# EAGLE schematic glove (EAGLE 6.6.0)

## Sheet 1 of 3
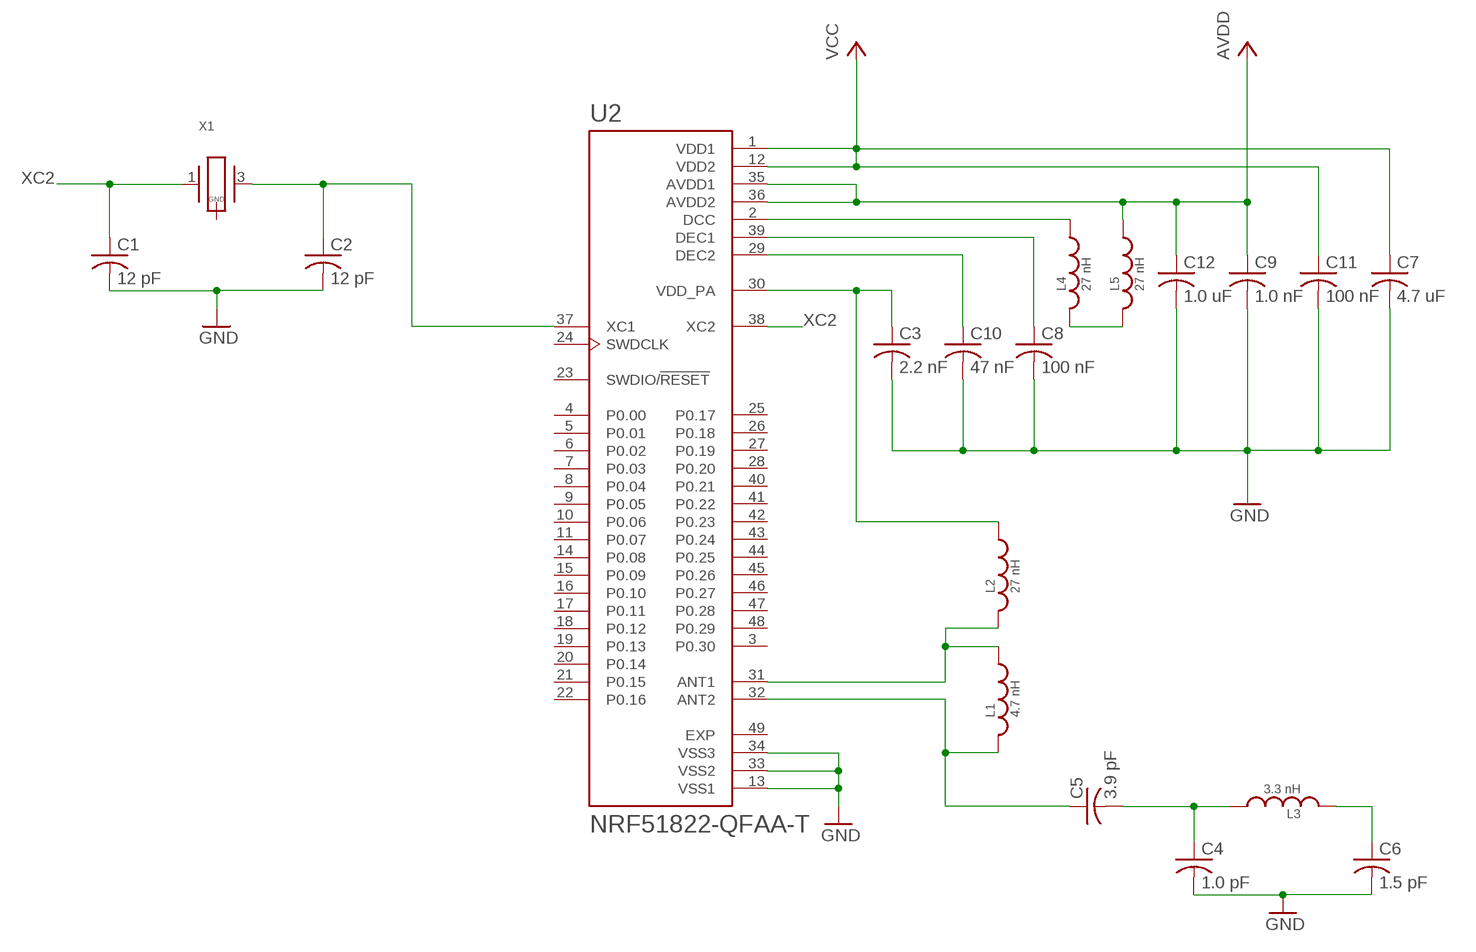
[diagram p0: schematic, sheet 1]

### Parts
C1  12 pF  C-USC0402  [C0402]
C2  12 pF  C-USC0402  [C0402]
C3  2.2 nF  C-USC0402  [C0402]
C4  1.0 pF  C-USC0402  [C0402]
C5  3.9 pF  C-USC0402  [C0402]
C6  1.5 pF  C-USC0402  [C0402]
C7  4.7 uF  C-USC0603  [C0603]
C8  100 nF  C-USC0402  [C0402]
C9  1.0 nF  C-USC0402  [C0402]
C10  47 nF  C-USC0402  [C0402]
C11  100 nF  C-USC0402  [C0402]
C12  1.0 uF  C-USC0603  [C0603]
L1  4.7 nH  INDUCTOR0402  [0402_CAP]
L2  27 nH  INDUCTOR0402  [0402_CAP]
L3  3.3 nH  INDUCTOR0402  [0402_CAP]
L4  27 nH  INDUCTOR0402  [0402_CAP]
L5  27 nH  INDUCTOR0402  [0402_CAP]
U2  NRF51822-QFAA-T  [QFN40P600X600X90-49N]
X1  FH1600015  [FHXXX]

### Nets
GND: C1.2 C2.2 C4.2 C6.2 U2.13(VSS1) U2.33(VSS2) U2.34(VSS3)
N$1: C3.2 C7.2 C8.2 C9.2 C10.2 C11.2 C12.2 ; supply symbol labelled GND
N$2: L1.1 L2.2 U2.31(ANT1)
N$3: C8.1 U2.39(DEC1)
N$4: C10.1 U2.29(DEC2)
N$5: C5.1 L1.2 U2.32(ANT2)
N$6: C3.1 L2.1 U2.30(VDD_PA)
N$7: C4.1 C5.2 L3.1
N$8: C6.1 L3.2
N$10: L4.1 U2.2(DCC)
N$11: L4.2 L5.2
N$13: C2.1 U2.37(XC1) X1.3
VCC: C7.1 C9.1 C11.1 C12.1 L5.1 U2.1(VDD1) U2.12(VDD2) U2.35(AVDD1) U2.36(AVDD2) ; supply symbol labelled AVDD
XC2: C1.1 U2.38(XC2) X1.1
Unconnected: U2.3(P0.30) U2.4(P0.00) U2.5(P0.01) U2.6(P0.02) U2.7(P0.03) U2.8(P0.04) U2.9(P0.05) U2.10(P0.06) U2.11(P0.07) U2.14(P0.08) U2.15(P0.09) U2.16(P0.10) U2.17(P0.11) U2.18(P0.12) U2.19(P0.13) U2.20(P0.14) U2.21(P0.15) U2.22(P0.16) U2.23(SWDIO/!RESET) U2.24(SWDCLK) U2.25(P0.17) U2.26(P0.18) U2.27(P0.19) U2.28(P0.20) U2.40(P0.21) U2.41(P0.22) U2.42(P0.23) U2.43(P0.24) U2.44(P0.25) U2.45(P0.26) U2.46(P0.27) U2.47(P0.28) U2.48(P0.29) X1.2(GND) X1.4(GND)

## Sheet 2 of 3
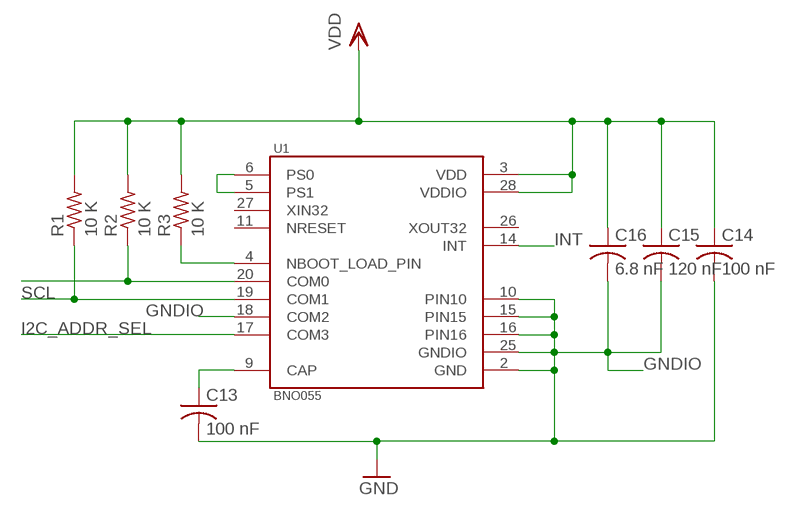
[diagram p1: schematic, sheet 2]

### Parts
C13  100 nF  C-USC0603  [C0603]
C14  100 nF  C-USC0603  [C0603]
C15  120 nF  C-USC0603  [C0603]
C16  6.8 nF  C-USC0603  [C0603]
R1  10 K  R-US_R0603  [R0603]
R2  10 K  R-US_R0603  [R0603]
R3  10 K  R-US_R0603  [R0603]
U1  BNO055  [LGA28R50P4X10_380X520X100]

### Nets
GNDIO: C13.2 C14.2 C15.2 C16.2 U1.2(GND) U1.10(PIN10) U1.15(PIN15) U1.16(PIN16) U1.18(COM2) U1.25(GNDIO) ; supply symbol labelled GND
I2C_ADDR_SEL: U1.17(COM3)
INT: U1.14(INT)
N$9: C13.1 U1.9(CAP)
N$12: U1.5(PS1) U1.6(PS0)
N$17: R2.1 U1.20(COM0)
N$18: R3.1 U1.4(NBOOT_LOAD_PIN)
SCL: R1.1 U1.19(COM1)
VDD: C14.1 C15.1 C16.1 R1.2 R2.2 R3.2 U1.3(VDD) U1.28(VDDIO)
Unconnected: U1.11(NRESET) U1.26(XOUT32) U1.27(XIN32)

## Sheet 3 of 3
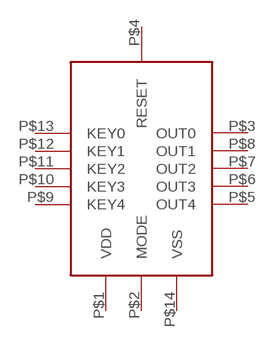
[diagram p2: schematic, sheet 3]

### Parts
U$1  QT1070  [QT1070]
Unconnected: U$1.P$1(VDD) U$1.P$2(MODE) U$1.P$3(OUT0) U$1.P$4(RESET) U$1.P$5(OUT4) U$1.P$6(OUT3) U$1.P$7(OUT2) U$1.P$8(OUT1) U$1.P$9(KEY4) U$1.P$10(KEY3) U$1.P$11(KEY2) U$1.P$12(KEY1) U$1.P$13(KEY0) U$1.P$14(VSS)

## Power pins joined to a net without a drawn wire
EXP: U2.49(EXP)

## Library data of the parts
C1-C16 = rcl:C-US: CAPACITOR, American symbol
L1-L5 = passives:INDUCTOR: A very specific inductor
R1-R3 = rcl:R-US_: RESISTOR, American symbol
U1 = BNO055:BNO055: BNO055 9-axis Absolute Orientation Sensor ( SiP ) w/Sensors and Sensor Fusion; AVAILABILITY: Good; DESCRIPTION: BNO055 9-axis Absolute Orientation Sensor ( SiP ) w/Sensors and Sensor Fusion; MF: Bosch; MP: BNO055; PACKAGE: LGA-28 Bosch; PRICE: 9.48 USD
U2 = NRF51822-QFAA-T:NRF51822-QFAA-T: Ble / 2.4ghz Rf Soc 48-Pin 6x6mm Qfn Wit; AVAILABILITY: Good; DESCRIPTION: Ble / 2.4ghz Rf Soc 48-Pin 6x6mm Qfn Wit; MF: Nordic Semiconductor; MP: NRF51822-QFAA-T; PACKAGE: QFN-48 Nordic Semiconductor; PRICE: 2.78 USD
U$1 = QT1070:QT1070
X1 = crystals:FH1600015: Pericom Type FH 16 MHz 2.5 x 2.0 mm; DIGIKEY: FH1600015CT-ND